# EAGLE design Adapter_V6 (EAGLE 8.7.1)
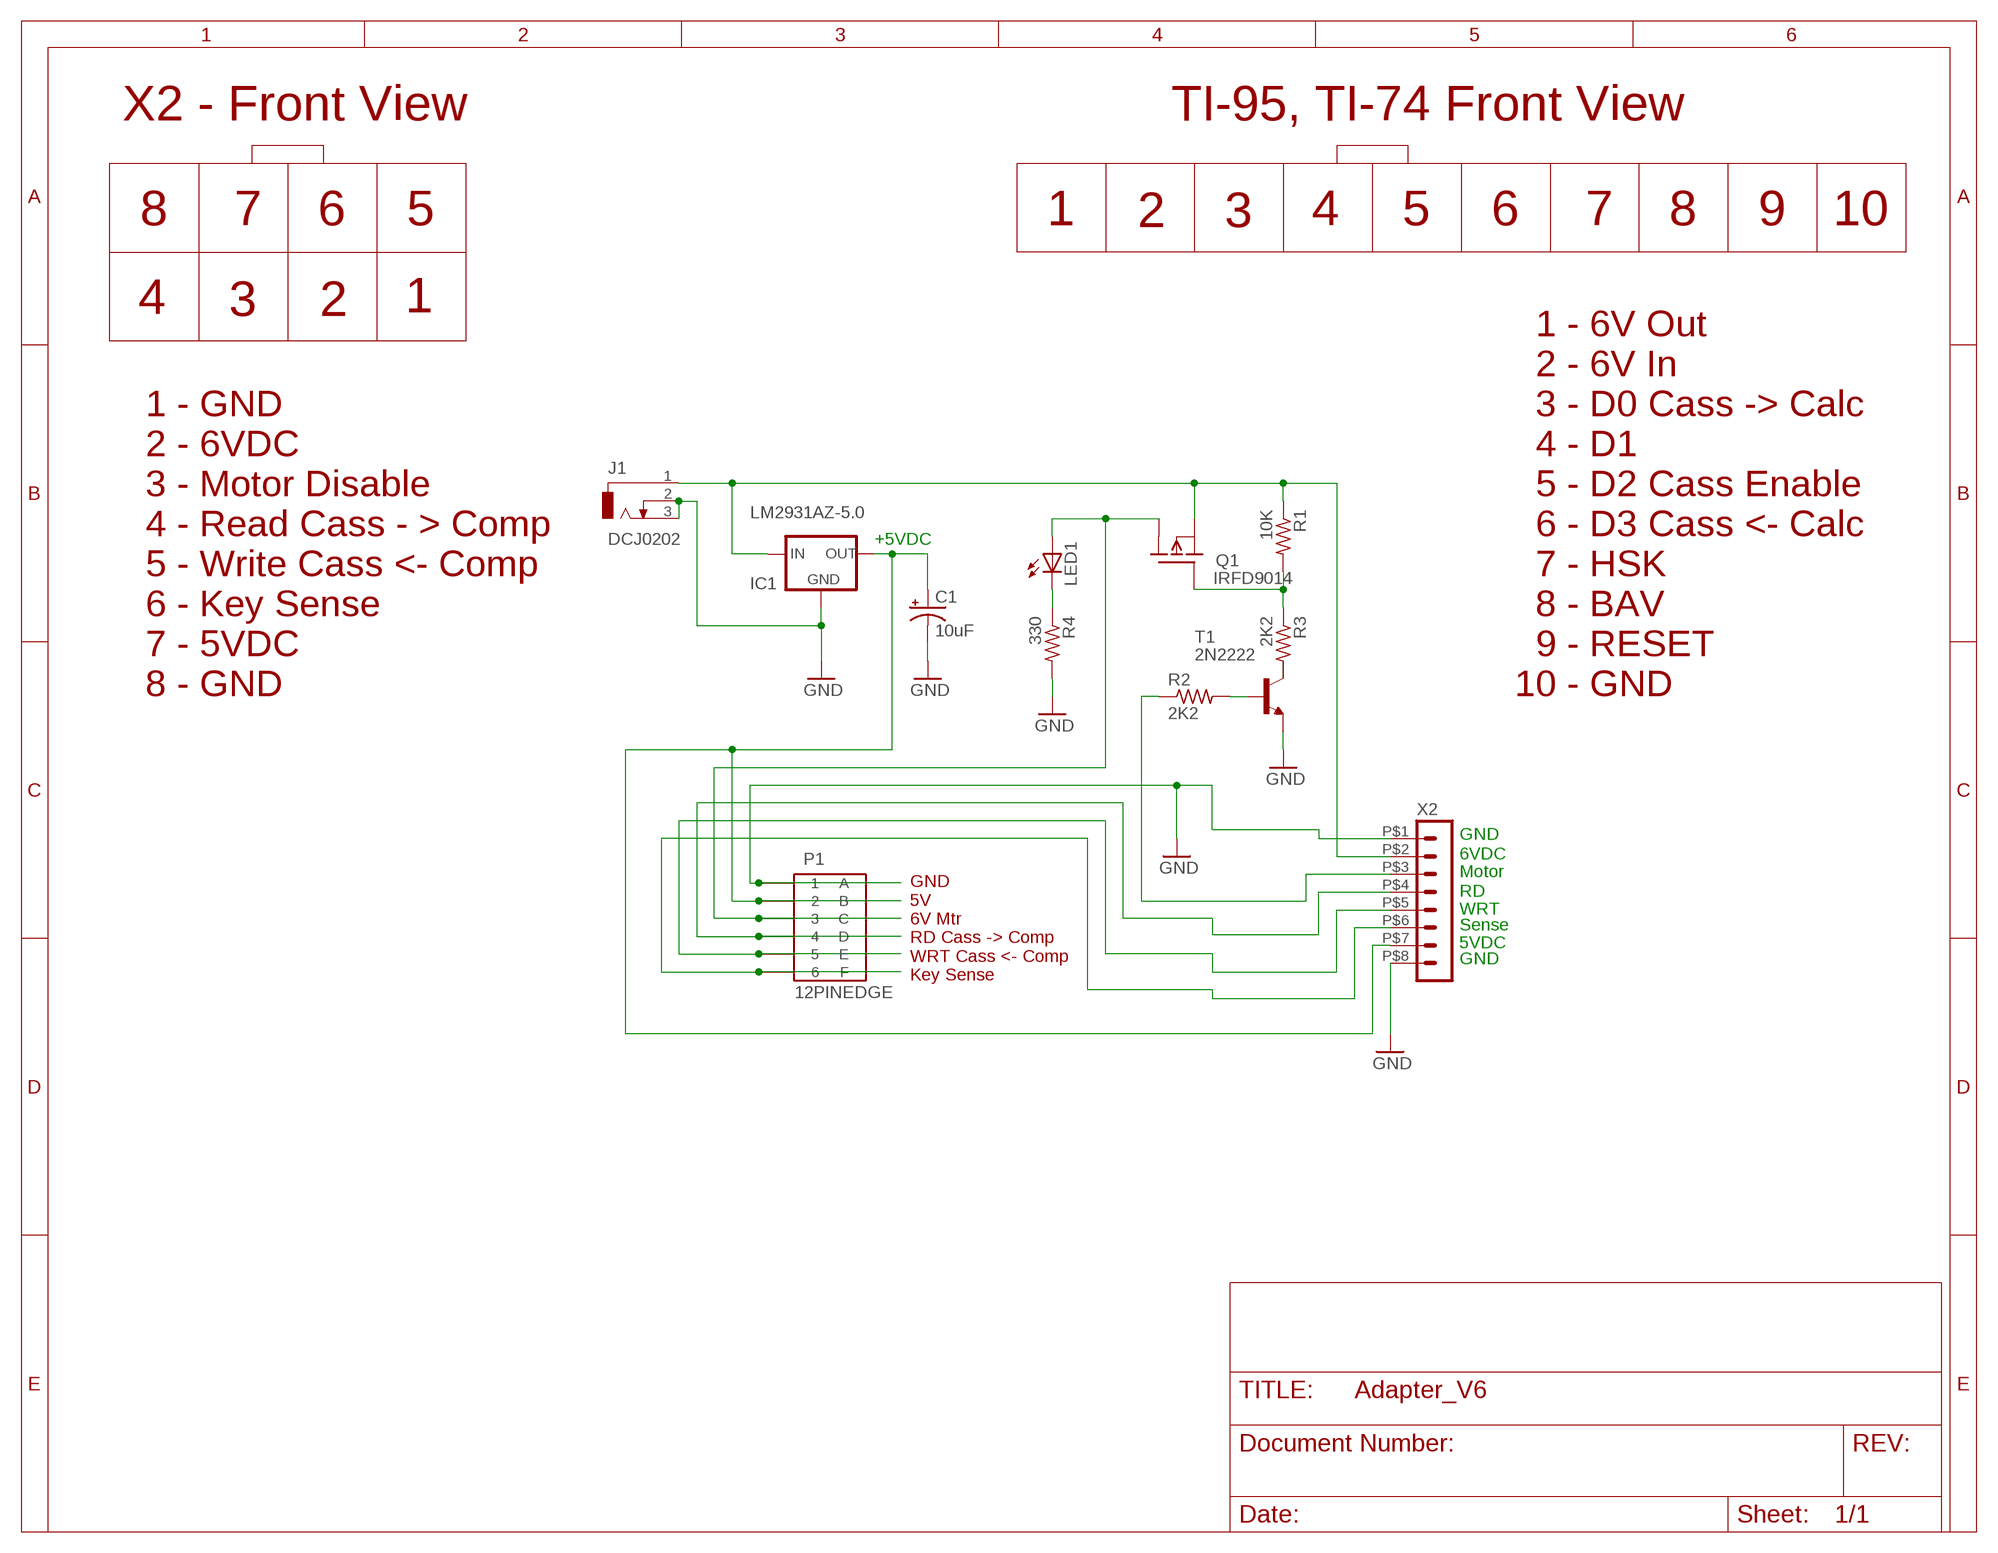
[diagram p0: schematic, sheet 1]

## Parts
C1  10uF  CPOL-USE1.8-4  [E1,8-4]
IC1  LM2931AZ-5.0  [TO92]
J1  DCJ0202  [DCJ0202]
LED1  LED5MM  [LED5MM]
P1  12PINEDGE  [12PINEDGE]
Q1  IRFD9014  [DIL04]
R1  10K  R-US_0207/10  [0207/10]
R2  2K2  R-US_0207/10  [0207/10]
R3  2K2  R-US_0207/10  [0207/10]
R4  330  R-US_0207/10  [0207/10]
T1  2N2222  [TO18]
X2  HEADER_POS8_43045-0800  [43045-0800]

## Nets
GND: C1.- IC1.2(GND) J1.2 J1.3 P1.1 P1.A R4.2 T1.1(E) X2.P$1 X2.P$8
N$1: IC1.3(IN) J1.1 Q1.2(S) R1.1 X2.P$2
N$2: C1.+ IC1.1(OUT) P1.2 P1.B X2.P$7
N$3: R2.1 X2.P$3
N$4: P1.4 P1.D X2.P$4
N$5: P1.5 P1.E X2.P$5
N$6: P1.6 P1.F X2.P$6
N$7: R2.2 T1.2(B)
N$8: LED1.A P1.3 P1.C Q1.3(D1)
N$10: R3.2 T1.3(C)
N$11: Q1.1(G) R1.2 R3.1
N$12: LED1.K(C) R4.1
Unconnected: Q1.4(D)

## Notes on the sheet
- X2 - Front View | TI-95, TI-74 Front View
- 8 | 7 | 6 | 5 | 1 | 2 | 3 | 4 | 5 | 6 | 7 | 8 | 9 | 10
- 4 | 3 | 2 | 1
- +5VDC
- 1 - GND
  2 - 6VDC
  3 - Motor Disable
  4 - Read Cass - > Comp
  5 - Write Cass <- Comp
  6 - Key Sense
  7 - 5VDC
  8 - GND
- 1 - 6V Out
    2 - 6V In
    3 - D0 Cass -> Calc
    4 - D1
    5 - D2 Cass Enable
    6 - D3 Cass <- Calc
    7 - HSK
    8 - BAV
    9 - RESET
  10 - GND
- GND
- 6VDC
- Motor
- RD
- WRT
- Sense
- 5VDC
- GND
- GND
  5V
  6V Mtr
  RD Cass -> Comp
  WRT Cass <- Comp
  Key Sense

## Library data of the parts
C1 = rcl:CPOL-US: POLARIZED CAPACITOR, American symbol; SPICEPREFIX: C
IC1 = v-reg:LM2931?*: www.ti.com/product/LM2931-N
J1 = con-jack:DCJ0202: DC POWER JACK Source: DCJ0202.pdf; OC_FARNELL: unknown; OC_NEWARK: unknown
LED1 = led:LED: LED OSRAM: - CHIPLED LG R971, LG N971, LY N971, LG Q971, LY Q971, LO R971, LY R971 LH N974, LH R974 LS Q976, LO Q976, LY Q976 LO Q996 - Hyper CHIPLED LW Q18S LB Q993, LB Q99A, LB R99A - SideLED LS A670, LO A670, LY A670, LG A670, LP A670 LB A673, LV A673, LT A673, LW A673 LH A674 LY A675 LS A676, LA A676, LO A676, LY A676, LW A676 LS A679, LY A679, LG A679 - Hyper Micro SIDELED® LS Y876, LA Y876, LO Y876, LY Y876 LT Y87S - SmartLED LW L88C, LW L88S LB L89C, LB L89S, LG L890 LS L89K, LO L89K, LY L89K LS L896, LA L896, LO L896, LY L896 - TOPLED LS T670, LO T670, LY T670, LG T670, LP T670 LSG T670, LSP T670, LSY T670, LOP T670, LYG T670 LG T671, LOG T671, LSG T671 LB T673, LV T673, LT T673, LW T673 LH T674 LS T676, LA T676, LO T676, LY T676, LB T676, LH T676, LSB T676, LW T676 LB T67C, LV T67C, LT T67C, LS T67K, LO T67K, LY T67K, LW E67C LS E67B, LA E67B, LO E67B, LY E67B, LB E67C, LV E67C, LT E67C LW T67C LS T679, LY T679, LG T679 LS T770, LO T770, LY T770, LG T770, LP T770 LB T773, LV T773, LT T773, LW T773 LH T774 LS E675, LA E675, LY E675, LS T675 LS T776, LA T776, LO T776, LY T776, LB T776 LHGB T686 LT T68C, LB T68C - Hyper Mini TOPLED® LB M676 - Mini TOPLED Santana® LG M470 LS M47K, LO M47K, LY M47K Source: http://www.osram.convergy.de LUXEON: - LUMILED® LXK2-PW12-R00, LXK2-PW12-S00, LXK2-PW14-U00, LXK2-PW14-V00 LXK2-PM12-R00, LXK2-PM12-S00, LXK2-PM14-U00 LXK2-PE12-Q00, LXK2-PE12-R00, LXK2-PE12-S00, LXK2-PE14-T00, LXK2-PE14-U00 LXK2-PB12-K00, LXK2-PB12-L00, LXK2-PB12-M00, LXK2-PB14-N00, LXK2-PB14-P00, LXK2-PB14-Q00 LXK2-PR12-L00, LXK2-PR12-M00, LXK2-PR14-Q00, LXK2-PR14-R00 LXK2-PD12-Q00, LXK2-PD12-R00, LXK2-PD12-S00 LXK2-PH12-R00, LXK2-PH12-S00 LXK2-PL12-P00, LXK2-PL12-Q00, LXK2-PL12-R00 Source: www.luxeon.com KINGBRIGHT: KA-3528ASYC Source: www.kingbright.com
P1 = edge-156:12PINEDGE: 12 PIN EDGE CONNECTOR FOR PCB
Q1 = transistor-fet:IRFD9014: P-Channel Enhancement MOSFET
R1-R4 = rcl:R-US_: RESISTOR, American symbol; SPICEPREFIX: R
T1 = transistor:2N2222: NPN TRANSISTOR
X2 = con-molex-micro-fit-3_0:HEADER_POS8_?: Molex - Micro-Fit 3.0 Series connector, 3.00mm (0.118") pitch header, 8 positions.

## Board
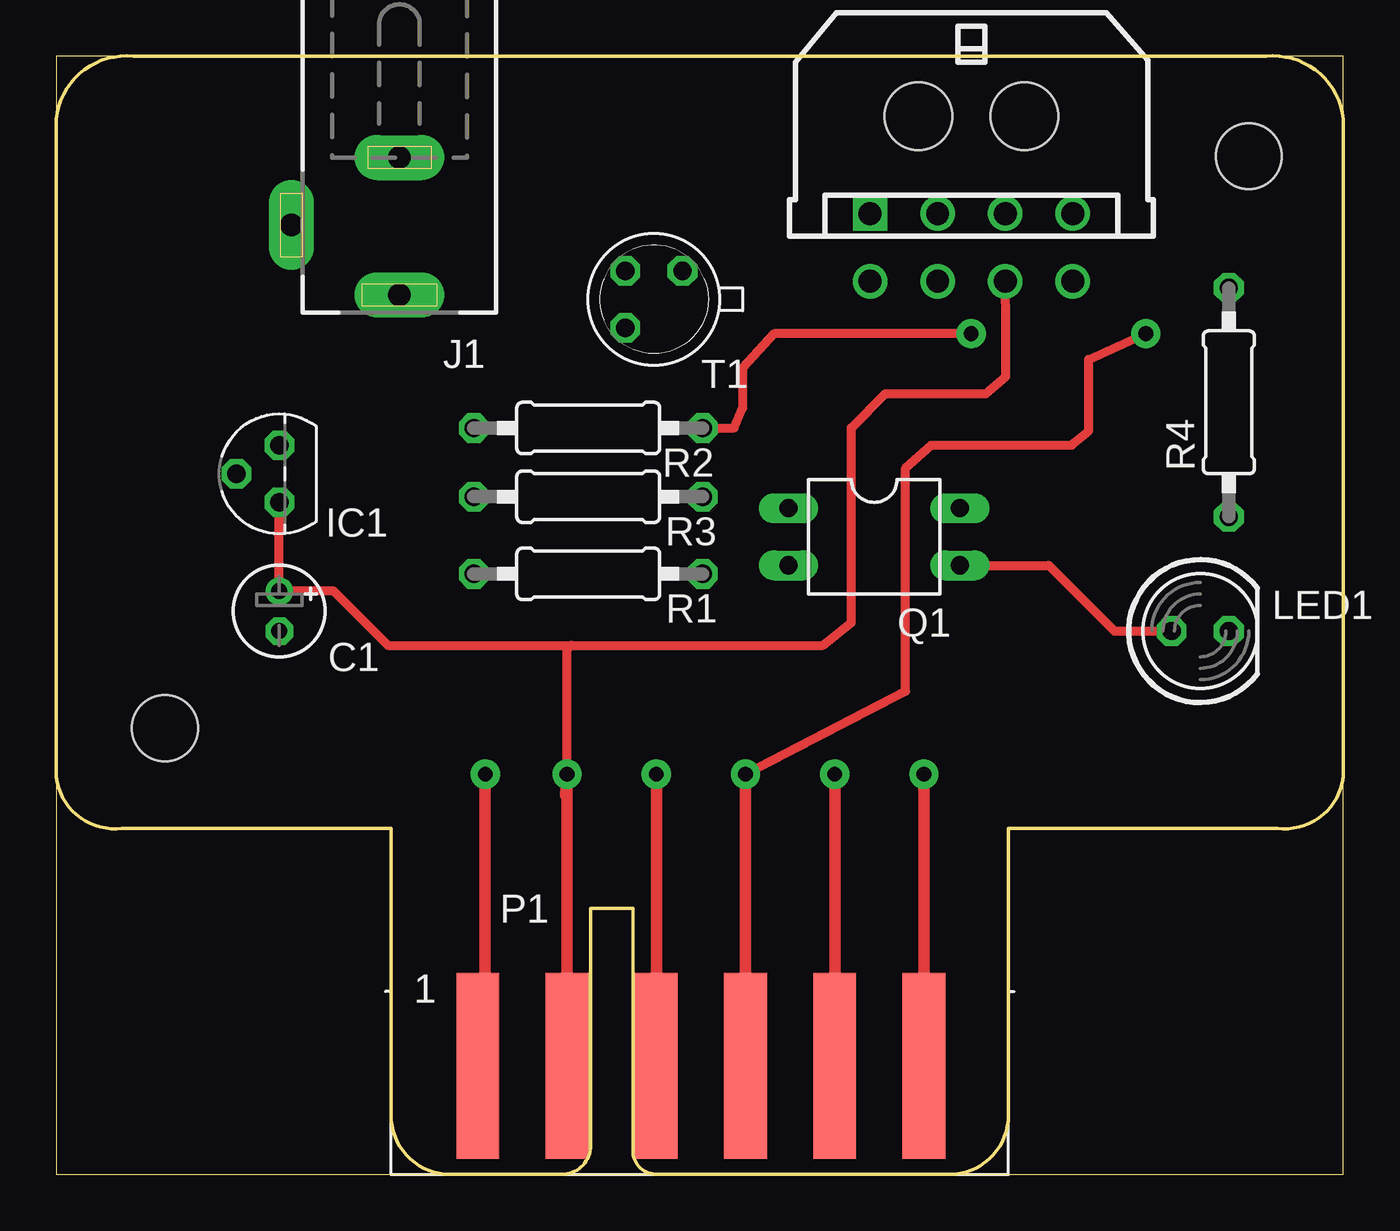
[diagram p1: board, top side]
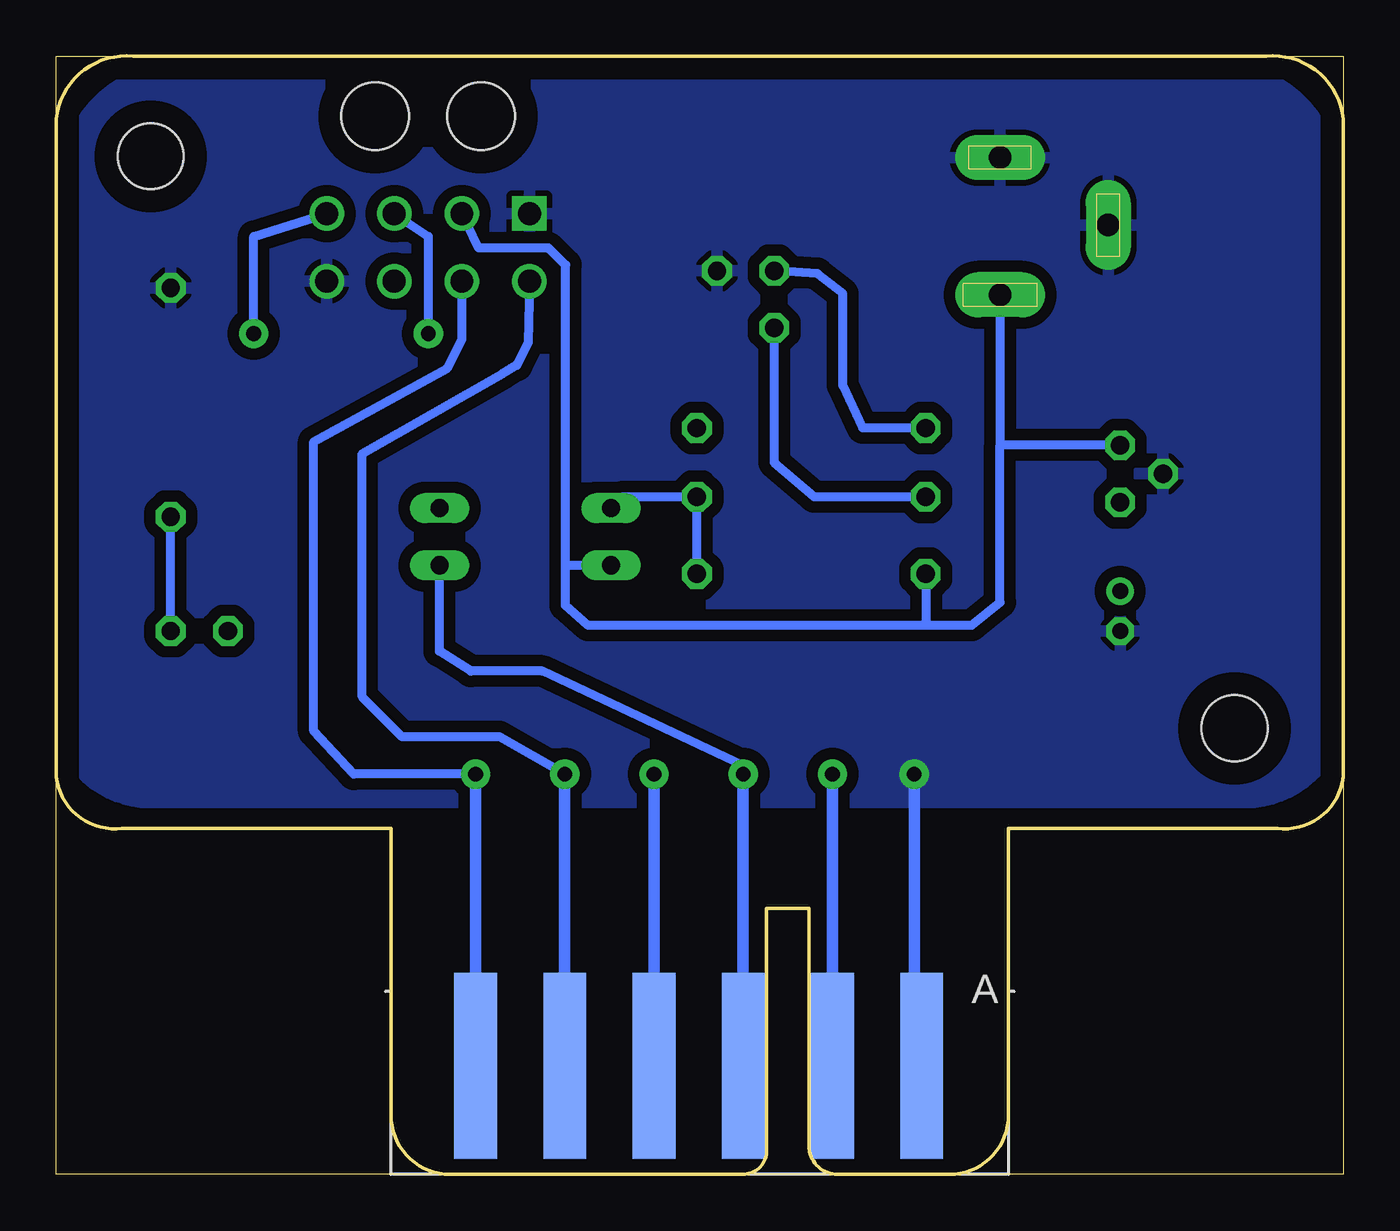
[diagram p2: board, bottom side, seen from below]

Size 57.15 x 49.66 mm. Coordinates in mm from the lower left corner, seen from the top.
Outline: 57.15,0 57.15,49.66 0,49.66 0,0 57.15,0
Copper layers (1*16): Top 0.035mm / dielectric 1.5mm / Bottom 0.035mm
Design rules "default *": minimum track width 6mil, minimum drill 0.35mm, track to track 20mil, track to pad 20mil, pad to pad 20mil, via to via 20mil, smd to smd 6mil, copper to edge 40mil, drill to drill 6mil, minimum pad ring 10mil, minimum via ring 8mil, stop-mask expansion 4mil, vias tented up to drill 0mil, thermal gap 10mil
Holes 2.95 mm at 4.83,19.81
Holes 2.92 mm at 52.96,45.21
Milling: 20 lines

### Footprints (pad centres in the part's own frame; a part is rotated, then mirrored left to right if it is on the bottom)
E1,8-4 = drill 0.711 pad 1.168: + -0.889,0 | drill 0.711 pad 1.168 octagon: - 0.889,0
TO92 = drill 0.813 octagon: 1 -1.27,0; 2 0,1.905; 3 1.27,0
DCJ0202 = drill 1 pad 2 long: 1 0,3.1; 2 4.8,0; 3 0,-3
LED5MM = drill 0.813 octagon: A -1.27,0; K 1.27,0
12PINEDGE = smd 1.905 x 8.255: 1 -9.855,4.826; 2 -5.893,4.826; 3 -1.93,4.826; 4 2.032,4.826; 5 5.994,4.826; 6 9.957,4.826 | smd 1.905 x 8.255 bottom: A -9.855,4.826; B -5.893,4.826; C -1.93,4.826; D 2.032,4.826; E 5.994,4.826; F 9.957,4.826
DIL04 = drill 0.813 long: 1 -1.27,-3.81; 2 1.27,-3.81; 3 1.27,3.81; 4 -1.27,3.81
0207/10 = drill 0.813 octagon: 1 -5.08,0; 2 5.08,0
TO18 = drill 0.813 octagon: 1 -1.27,-1.27; 2 1.27,-1.27; 3 1.27,1.27
43045-0800 = drill 1.02 square: P$1 4.5,4.32 | drill 1.02: P$2 1.5,4.32; P$3 -1.5,4.32; P$4 -4.5,4.32; P$5 4.5,7.32; P$6 1.5,7.32; P$7 -1.5,7.32; P$8 -4.5,7.32 | hole 3: 2.35,0; -2.35,0

### Placement (x,y rotation side)
C1  9.91,25.02 270 top
IC1  9.91,31.11 90 top
J1  15.24,42.16 180 top
LED1  50.8,24.13 0 top
P1  28.57,0 0 top
Q1  36.32,28.32 270 top
R1  23.62,26.67 0 top
R2  23.62,33.15 180 top
R3  23.62,30.1 180 top
R4  52.07,34.29 90 top
T1  26.54,38.86 180 top
X2  40.64,46.99 180 top

### Tracks (layer width: path | path; a pad name or v marks a point on that pad's centre or on a via)
GND  (via drill 0.65 pad 1.3)
  Top 0.508: P1.A 19.05,5.13 v19.05,17.78
  Bottom 0.508: P1.A 19.05,5.13 v19.05,17.78
  pour Bottom: 53,16.51 4.34,16.51 arc-90 0,20.85 0,43.18 arc-90 6.35,49.53 50.8,49.53 arc-90 57.15,43.18 57.15,20.66 arc-90
N$1
  Bottom 0.406: X2.P$2 38.39,41.15 36.73,41.14 35.29,41.14 34.52,40.39 34.54,38.99 34.54,27.05 | 15.24,32.38 15.24,25.4 16.51,24.38 18.54,24.38 | IC1.3 15.24,32.38 | 18.54,24.38 33.53,24.38 34.54,25.27 34.54,27.05 | J1.1 15.24,32.38 | Q1.2 34.54,27.05 | R1.1 18.54,24.38
N$2  (via drill 0.65 pad 1.3)
  Top 0.406: X2.P$7 42.16,37.66 42.16,35.43 41.27,34.67 36.83,34.67 35.31,33.15 35.31,24.51 34.04,23.5 22.86,23.5 | IC1.1 C1.+ 12.32,25.91 14.73,23.5 22.86,23.5 | v22.68,17.78 22.68,23.32 22.86,23.5
  Top 0.508: P1.B v22.68,17.78 22.61,16.84
  Bottom 0.508: P1.B v22.68,17.78
N$3  (via drill 0.65 pad 1.3)
  Top 0.406: R2.1 30.1,33.15 30.48,34.04 30.48,35.81 31.86,37.34 v40.63,37.34
  Bottom 0.406: v40.63,37.34 40.63,41.66 X2.P$3
N$4  (via drill 0.65 pad 1.3)
  Top 0.406: v30.61,17.78 37.72,21.46 37.72,31.37 38.86,32.38 45.09,32.38 45.85,33.02 45.85,36.2 v48.39,37.34
  Top 0.508: P1.D v30.61,17.78
  Bottom 0.406: v48.39,37.34 48.38,41.65 X2.P$4
  Bottom 0.508: P1.D v30.61,17.78
N$5  (via drill 0.65 pad 1.3)
  Top 0.508: P1.E v34.57,17.78
  Bottom 0.406: v34.57,17.78 37.47,19.43 41.78,19.43 43.56,21.21 43.56,32 37.34,35.56 36.7,35.94 36.2,36.95 X2.P$5
  Bottom 0.508: 34.29,3.81 34.57,4.09 P1.E v34.57,17.78
N$6  (via drill 0.65 pad 1.3)
  Top 0.508: P1.F v38.53,17.78
  Bottom 0.406: v38.53,17.78 43.94,17.78 45.72,19.68 45.72,32.54 39.78,35.81 39.14,37.09 X2.P$6
  Bottom 0.508: P1.F v38.53,17.78
N$7
  Bottom 0.406: R2.2 21.34,33.15 22.23,35.05 22.23,39.12 23.37,40.01 T1.2
N$8  (via drill 0.65 pad 1.3)
  Top 0.406: Q1.3 44.07,27.05 46.99,24.13 LED1.A
  Top 0.508: P1.C v26.64,17.78
  Bottom 0.406: v26.64,17.78 26.64,18.16 35.56,22.35 38.73,22.35 40.13,23.24 Q1.3
  Bottom 0.508: P1.C v26.64,17.78
N$10
  Bottom 0.406: R3.2 23.5,30.1 25.27,31.62 T1.3
N$11
  Bottom 0.406: Q1.1 32,30.1 R3.1 R1.2
N$12
  Bottom 0.406: LED1.K R4.1